# Altium schematic sheet USB.SchDoc
size A
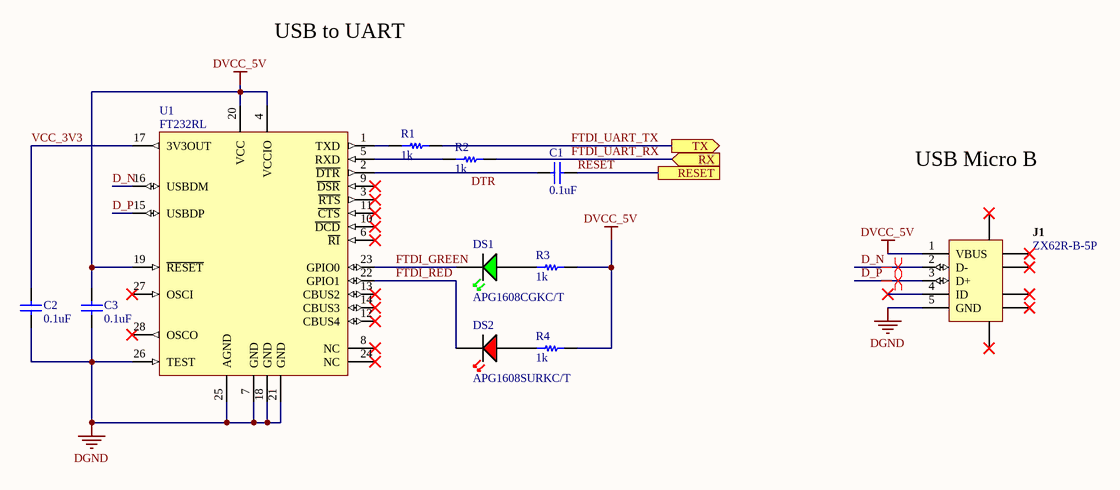
[diagram p0: USB.SchDoc]

## Parts
C1  0.1uF  [CAP SMT 0603]
C2  0.1uF  [CAP SMT 0603]
C3  0.1uF  [CAP SMT 0603]
DS1  APG1608CGKC/T  [GREEN LED]
DS2  APG1608SURKC/T  [RED LED]
J1  ZX62R-B-5P  [HIRO-ZX62R-B-5P_V]
R1  1k  [RES SMT 0805]
R2  1k  [RES SMT 0805]
R3  1k  [RES SMT 0805]
R4  1k  [RES SMT 0805]
U1  FT232RL  [SSOP-28_L]

## Ports
RESET, RX (in), TX (out)

## Nets
DGND: C2.1 C3.1 J1.5(GND) U1.7(GND) U1.18(GND) U1.21(GND) U1.25(AGND) U1.26(TEST)
DVCC_5V: C3.2 J1.1(VBUS) R3.2 R4.2 U1.4(VCCIO) U1.19(~{RESET}) U1.20(VCC)
D_N: J1.2(D-) U1.16(USBDM)
D_P: J1.3(D+) U1.15(USBDP)
DTR: C1.1 U1.2(~{DTR})
FTDI_GREEN: DS1.1 U1.23(GPIO0)
FTDI_RED: DS2.1 U1.22(GPIO1)
FTDI_UART_RX: R2.2 ; port RX
FTDI_UART_TX: R1.2 ; port TX
RESET: C1.2 ; port RESET
VCC_3V3: C2.2 U1.17(3V3OUT)
NetDS1_2: DS1.2 R3.1
NetDS2_2: DS2.2 R4.1
NetR1_1: R1.1 U1.1(TXD)
NetR2_1: R2.1 U1.5(RXD)

Not connected (* = marked no-connect by the designer): J1 4(ID)* 6(SHLD)* 7(SHLD)* 8(SHLD)* 9(SHLD)* 10(SHLD)* 11(SHLD)*; U1 3(~{RTS})* 6(~{RI})* 8(NC)* 9(~{DSR})* 10(~{DCD})* 11(~{CTS})* 12(CBUS4)* 13(CBUS2)* 14(CBUS3)* 24(NC)* 27(OSCI)* 28(OSCO)*

## Layout directives
differential pair: D_N, D_P

## Notes on the sheet
- USB to UART
- USB Micro B

## Library data of the parts
C1-C3 = Capacitor 0.1uF 25V 0603: Supplier 1: Digi-Key; Supplier Part Number 1: 445-5667-6-ND
DS1 = Green LED: Supplier 1: Digi-Key; Supplier Part Number 1: 754-1357-6-ND
DS2 = RED LED: Supplier 1: Digi-Key; Supplier Part Number 1: 754-1359-6-ND
J1 = CMP-0031-00001-1: Connector; USBMicro-B,Reverse type, SMT; 5 Position; Right Angle; DatasheetVersion: 08/2010; Operating Temperature: -30 to 85 degC; Mounting Technology: Surface Mount; PartNumber: ZX62R-B-5P; PackageReference: ZX62R-B-5P; ComponentLink2URL: http://www.hirose.co.jp/cataloge_hp/e24200011.pdf; ComponentLink1URL: http://www.hirose.com/â€Ž; ComponentLink2Description: Datasheet; PackageDescription: 5-Pin USB Micro-B R/A Connector; ComponentLink1Description: Manufacturer URL
R1-R4 = Resistor 1k 1% 0805: Supplier 1: Digi-Key; Supplier Part Number 1: 541-1.00KCDKR-ND
U1 = CMP-0078-00029-1: USB UART Asynchronous Serial Data Transfer Chip, SSOP-28, Tape and Reel; DatasheetVersion: ver 2.07, Jul-2010; PackageDescription: 28-Pin Small Outline Package 0.65 mm Pitch; PackageVersion: 2010; PackageReference: SSOP-28